# Altium schematic sheet Motor_Temp_Measurement.SchDoc: Motor temp measure
size A4; Engineer: Danel Tiitma; DocumentNumber: 12; Revision: 1; SheetNumber: 13; SheetTotal: 15
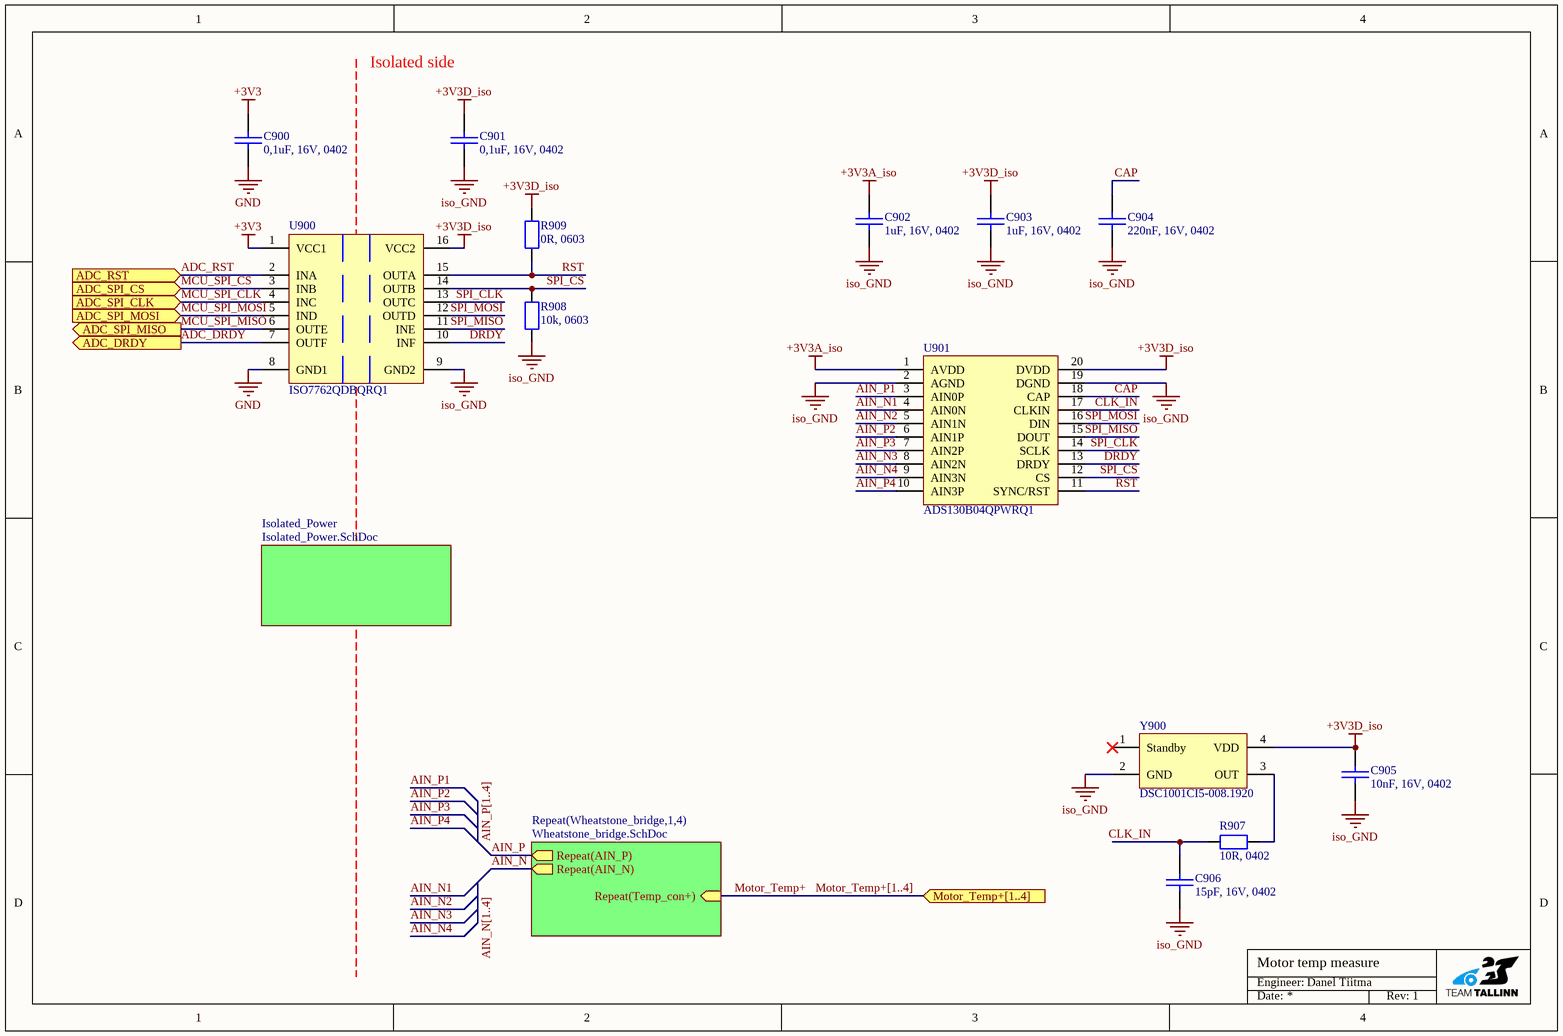
[diagram p0: Motor_Temp_Measurement.SchDoc]

## Parts
C900  0,1uF, 16V, 0402  [CAP [0402] 1005]
C901  0,1uF, 16V, 0402  [CAP [0402] 1005]
C902  1uF, 16V, 0402  [CAP [0402] 1005]
C903  1uF, 16V, 0402  [CAP [0402] 1005]
C904  220nF, 16V, 0402  [CAP [0402] 1005]
C905  10nF, 16V, 0402  [CAP [0402] 1005]
C906  15pF, 16V, 0402  [CAP [0402] 1005]
R907  10R, 0402  [RES [0402] 1005]
R908  10k, 0603  [RES [0603] 1608]
R909  0R, 0603  [RES [0603] 1608]
U900  ISO7762QDBQRQ1  [SSOP-16]
U901  ADS130B04QPWRQ1  [TSSOP-20]
Y900  DSC1001CI5-008.1920  [Crystal 3.2x2.5mm]

## Sub-sheets
Isolated_Power = Isolated_Power.SchDoc: no entries
Repeat(Wheatstone_bridge,1,4) = Wheatstone_bridge.SchDoc: Repeat(AIN_P) (out), Repeat(AIN_N) (out), Repeat(Temp_con+) (in)

## Ports
ADC_DRDY (out), ADC_RST (in), ADC_SPI_CLK (in), ADC_SPI_CS (in), ADC_SPI_MISO (out), ADC_SPI_MOSI (in), Motor_Temp+[1..4] (in)

## Nets
+3V3: C900.1 U900.1(VCC1)
+3V3A_iso: C902.2 U901.1(AVDD)
+3V3D_iso: C901.2 C903.2 C905.1 R909.1 U900.16(VCC2) U901.20(DVDD) Y900.4(VDD)
GND: C900.2 U900.8(GND1)
iso_GND: C901.1 C902.1 C903.1 C904.1 C905.2 C906.1 R908.2 U900.9(GND2) U901.2(AGND) U901.19(DGND) Y900.2(GND)
ADC_DRDY: U900.7(OUTF) ; port ADC_DRDY
ADC_RST: U900.2(INA) ; port ADC_RST
AIN_N: sheet Repeat(Wheatstone_bridge,1,4)/Repeat(AIN_N)
AIN_N1: U901.4(AIN0N)
AIN_N2: U901.5(AIN1N)
AIN_N3: U901.8(AIN2N)
AIN_N4: U901.9(AIN3N)
AIN_P: sheet Repeat(Wheatstone_bridge,1,4)/Repeat(AIN_P)
AIN_P1: U901.3(AIN0P)
AIN_P2: U901.6(AIN1P)
AIN_P3: U901.7(AIN2P)
AIN_P4: U901.10(AIN3P)
CAP: C904.2 U901.18(CAP)
CLK_IN: C906.2 R907.2 U901.17(CLKIN)
DRDY: U900.10(INF) U901.13(DRDY)
MCU_SPI_CLK: U900.4(INC) ; port ADC_SPI_CLK
MCU_SPI_CS: U900.3(INB) ; port ADC_SPI_CS
MCU_SPI_MISO: U900.6(OUTE) ; port ADC_SPI_MISO
MCU_SPI_MOSI: U900.5(IND) ; port ADC_SPI_MOSI
Motor_Temp+: sheet Repeat(Wheatstone_bridge,1,4)/Repeat(Temp_con+)
RST: R909.2 U900.15(OUTA) U901.11(SYNC/RST)
SPI_CLK: U900.13(OUTC) U901.14(SCLK)
SPI_CS: R908.1 U900.14(OUTB) U901.12(CS)
SPI_MISO: U900.11(INE) U901.15(DOUT)
SPI_MOSI: U900.12(OUTD) U901.16(DIN)
NetR907_1: R907.1 Y900.3(OUT)

Not connected (* = marked no-connect by the designer): Y900 1(Standby)*

## Buses and harness runs
bus AIN_N[1..4]
bus AIN_P[1..4]
bus Motor_Temp+[1..4] = port Motor_Temp+[1..4]

## Notes on the sheet
- Isolated side
- Engineer:
- Date:
- Rev:

## Library data of the parts
C900-C906 = CMP-001-00084-16: Default capacitor part; Supplier Part Number: *; Supplier: *; Manufacturer Part Number: *
R907-R909 = CMP-009-00038-12: Standard resistor part; Supplier Part Number: *; Manufacturer Part Number: *; Supplier: *
U900 = CMP-015-00010-2: Interface Circuit, CMOS, PDSO16; Manufacturer: Texas Instruments; Supplier: Mouser; Manufacturer Part Number: ISO7762QDBQRQ1; Price: 3,87; Datasheet: https://www.ti.com/general/docs/suppproductinfo.tsp?distId=26&gotoUrl=https://www.ti.com/lit/gpn/iso7762-q1; Supplier Part Number: 595-ISO7762QDBQRQ1
U901 = CMP-00029-4: Automotive 16-bit, 32-kSPS, four-channel, simultaneous-sampling, delta-sigma ADC 20-TSSOP -40 to 125; Manufacurer: Texas Instruments; Supplier: Digikey; Datasheet: https://www.ti.com/lit/ds/symlink/ads130b04-q1.pdf; Supplier Part Number: 296-ADS130B04QPWRQ1CT-ND; Manufacturer Part Number: ADS130B04QPWRQ1; Price: 6.28
Y900 = CMP-003-00000-1: CMOS Output Clock Oscillator, 8.192MHz Nom; Manufacturer Part Number: DSC1001DI5-008.1920T; Manufacturer: Microchip; Supplier: Mouser; Datasheet: https://www.mouser.ee/datasheet/2/268/MCHP_S_A0003587227_1-2520798.pdf; Supplier Part Number: 998-1001DI5008.1920T